# EAGLE schematic schematic-breadboard (EAGLE 7.4.0)
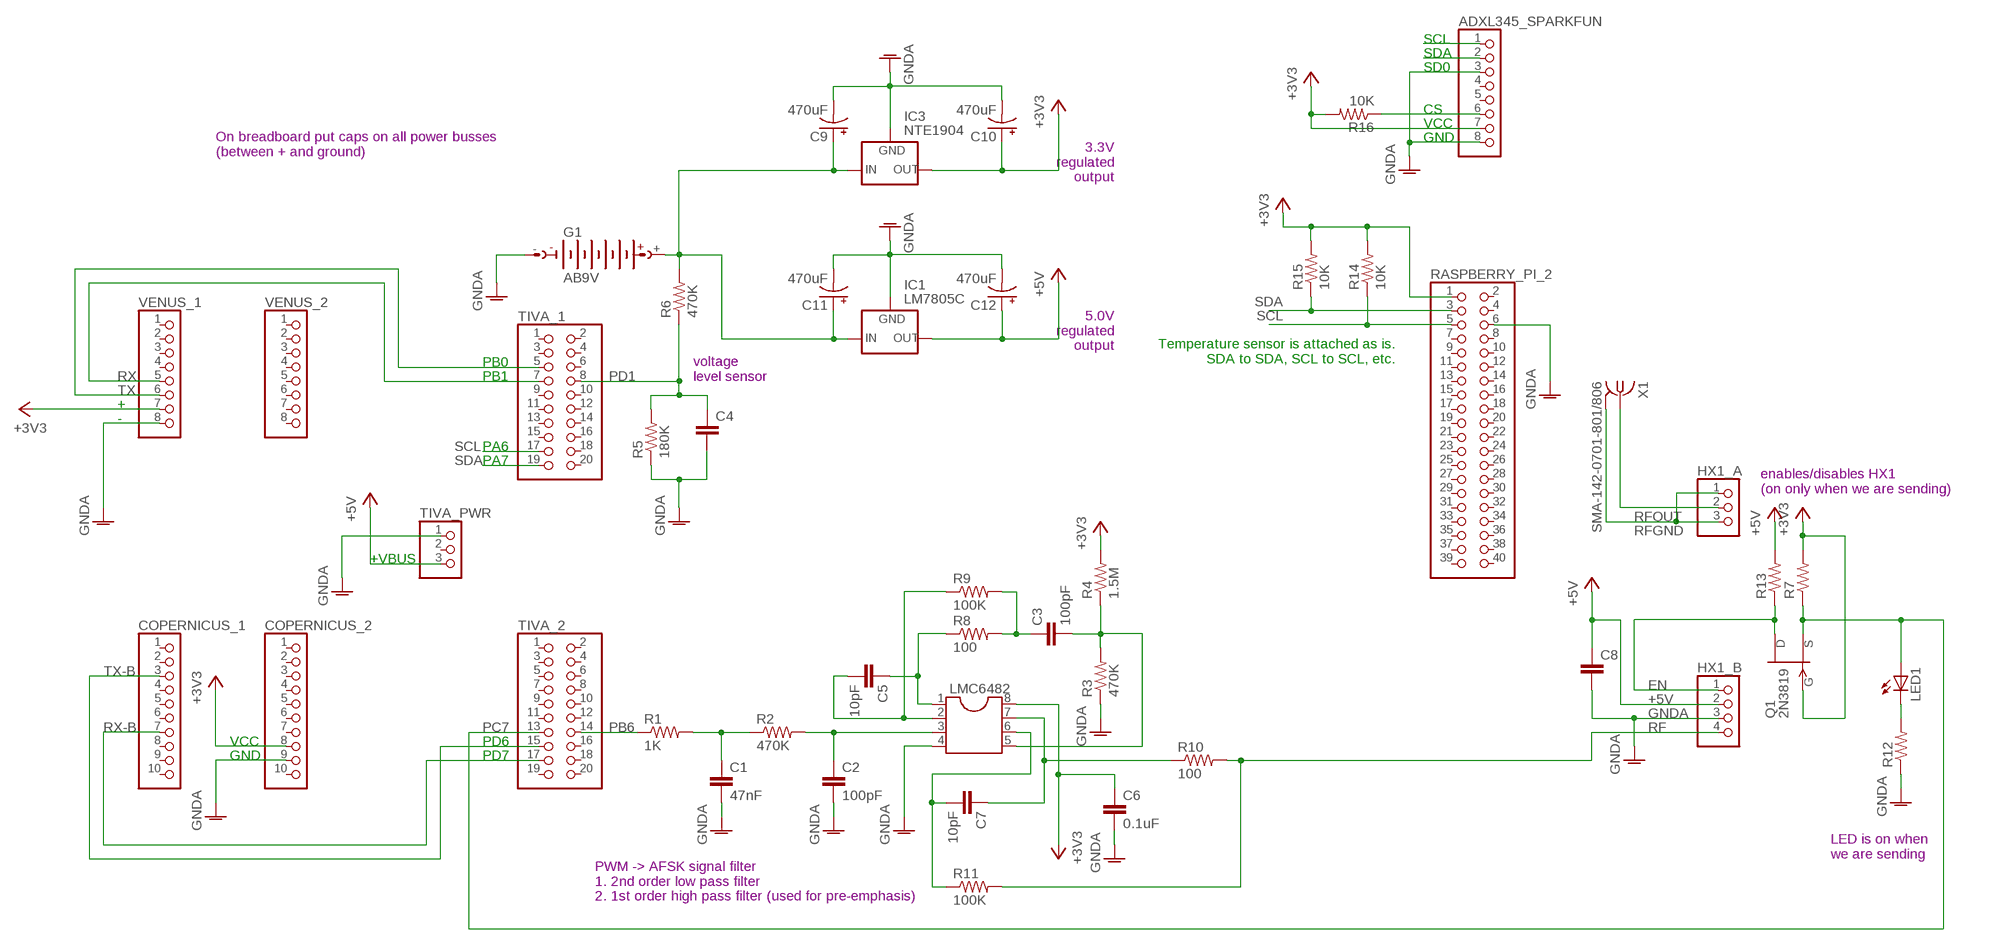
[diagram p0: schematic, sheet 1]

## Parts
ADXL345_SPARKFUN  PINHD-1X8  [1X08]
C1  47nF  C2.5/2  [C2.5-2]
C2  100pF  C2.5/2  [C2.5-2]
C3  100pF  C2.5/2  [C2.5-2]
C4  C2.5/2  [C2.5-2]
C5  10pF  C2.5/2  [C2.5-2]
C6  0.1uF  C2.5/2  [C2.5-2]
C7  10pF  C2.5/2  [C2.5-2]
C8  C2.5/2  [C2.5-2]
C9  470uF  CPOL-USE2,5-6E  [E2,5-6E]
C10  470uF  CPOL-USE2,5-6E  [E2,5-6E]
C11  470uF  CPOL-USE2,5-6E  [E2,5-6E]
C12  470uF  CPOL-USE2,5-6E  [E2,5-6E]
COPERNICUS_1  PINHD-1X10  [1X10]
COPERNICUS_2  PINHD-1X10  [1X10]
G1  AB9V  [AB9V]
HX1_A  PINHD-1X3  [1X03]
HX1_B  PINHD-1X4  [1X04]
IC1  LM7805C  79XXL  [79XXL]
IC3  NTE1904  79XXL  [79XXL]
LED1  LED3MM  [LED3MM]
LMC6482  DIL8  [DIL08]
Q1  2N3819  [TO92]
R1  1K  R-US_0204/2V  [0204V]
R2  470K  R-US_0204/2V  [0204V]
R3  470K  R-US_0204/2V  [0204V]
R4  1.5M  R-US_0204/2V  [0204V]
R5  180K  R-US_0204/2V  [0204V]
R6  470K  R-US_0204/2V  [0204V]
R7  R-US_0204/2V  [0204V]
R8  100  R-US_0204/2V  [0204V]
R9  100K  R-US_0204/2V  [0204V]
R10  100  R-US_0204/2V  [0204V]
R11  100K  R-US_0204/2V  [0204V]
R12  R-US_0204/2V  [0204V]
R13  R-US_0204/2V  [0204V]
R14  10K  R-US_0204/2V  [0204V]
R15  10K  R-US_0204/2V  [0204V]
R16  10K  R-US_0204/2V  [0204V]
RASPBERRY_PI_2  PINHD-2X20  [2X20]
TIVA_1  PINHD-2X10  [2X10]
TIVA_2  PINHD-2X10  [2X10]
TIVA_PWR  PINHD-1X3  [1X03]
VENUS_1  PINHD-1X8  [1X08]
VENUS_2  PINHD-1X8  [1X08]
X1  SMA-142-0701-801/806  [J502-ND-142-0701-801/806]

## Nets
+3V3: ADXL345_SPARKFUN.7 C6.1 C10.+ COPERNICUS_2.8 IC3.OUT LMC6482.8 Q1.2(G) R4.2 R7.2 R14.2 R15.2 R16.2 RASPBERRY_PI_2.1 VENUS_1.7
+5V: C8.1 C12.+ HX1_B.2 IC1.OUT R13.2 TIVA_PWR.3
+9V: C9.+ C11.+ G1.+ IC1.IN IC3.IN R6.2
EN: HX1_B.1 Q1.1(D) R13.1
GNDA: ADXL345_SPARKFUN.3 ADXL345_SPARKFUN.8 C1.2 C2.2 C4.2 C6.2 C8.2 C9.- C10.- C11.- C12.- COPERNICUS_2.9 G1.- HX1_B.3 IC1.GND IC3.GND LMC6482.4 R3.1 R5.1 R12.1 RASPBERRY_PI_2.6 TIVA_PWR.1 VENUS_1.8
N$2: C1.1 R1.2 R2.1
N$3: C2.1 LMC6482.3 R2.2
N$4: C7.2 LMC6482.6 R11.1
N$6: C3.2 LMC6482.5 R3.2 R4.1
N$8: C3.1 R8.2 R9.2
N$9: ADXL345_SPARKFUN.6 R16.1
N$12: C7.1 LMC6482.7 R10.1
N$13: C5.1 LMC6482.1 R8.1
N$15: C5.2 LMC6482.2 R9.1
N$17: LED1.K(C) R12.2
PB6: R1.1 TIVA_2.14
PC7: LED1.A Q1.3(S) R7.1 TIVA_2.13
PD1: C4.1 R5.2 R6.1 TIVA_1.8
RF: HX1_B.4 R10.2 R11.2
RFGND: HX1_A.1 HX1_A.3 X1.G@1 X1.G@2 X1.G@3 X1.G@4
RFOUT: HX1_A.2 X1.1
RX: TIVA_1.7 VENUS_1.5
RX-B: COPERNICUS_1.7 TIVA_2.17
SCL: R14.1 RASPBERRY_PI_2.5 TIVA_1.17
SDA: ADXL345_SPARKFUN.2 R15.1 RASPBERRY_PI_2.3 TIVA_1.19
SDL: ADXL345_SPARKFUN.1
TX: TIVA_1.5 VENUS_1.6
TX-B: COPERNICUS_1.3 TIVA_2.15
Unconnected: ADXL345_SPARKFUN.4 ADXL345_SPARKFUN.5 COPERNICUS_1.1 COPERNICUS_1.2 COPERNICUS_1.4 COPERNICUS_1.5 COPERNICUS_1.6 COPERNICUS_1.8 COPERNICUS_1.9 COPERNICUS_1.10 COPERNICUS_2.1 COPERNICUS_2.2 COPERNICUS_2.3 COPERNICUS_2.4 COPERNICUS_2.5 COPERNICUS_2.6 COPERNICUS_2.7 COPERNICUS_2.10 RASPBERRY_PI_2.2 RASPBERRY_PI_2.4 RASPBERRY_PI_2.7 RASPBERRY_PI_2.8 RASPBERRY_PI_2.9 RASPBERRY_PI_2.10 RASPBERRY_PI_2.11 RASPBERRY_PI_2.12 RASPBERRY_PI_2.13 RASPBERRY_PI_2.14 RASPBERRY_PI_2.15 RASPBERRY_PI_2.16 RASPBERRY_PI_2.17 RASPBERRY_PI_2.18 RASPBERRY_PI_2.19 RASPBERRY_PI_2.20 RASPBERRY_PI_2.21 RASPBERRY_PI_2.22 RASPBERRY_PI_2.23 RASPBERRY_PI_2.24 RASPBERRY_PI_2.25 RASPBERRY_PI_2.26 RASPBERRY_PI_2.27 RASPBERRY_PI_2.28 RASPBERRY_PI_2.29 RASPBERRY_PI_2.30 RASPBERRY_PI_2.31 RASPBERRY_PI_2.32 RASPBERRY_PI_2.33 RASPBERRY_PI_2.34 RASPBERRY_PI_2.35 RASPBERRY_PI_2.36 RASPBERRY_PI_2.37 RASPBERRY_PI_2.38 RASPBERRY_PI_2.39 RASPBERRY_PI_2.40 TIVA_1.1 TIVA_1.2 TIVA_1.3 TIVA_1.4 TIVA_1.6 TIVA_1.9 TIVA_1.10 TIVA_1.11 TIVA_1.12 TIVA_1.13 TIVA_1.14 TIVA_1.15 TIVA_1.16 TIVA_1.18 TIVA_1.20 TIVA_2.1 TIVA_2.2 TIVA_2.3 TIVA_2.4 TIVA_2.5 TIVA_2.6 TIVA_2.7 TIVA_2.8 TIVA_2.9 TIVA_2.10 TIVA_2.11 TIVA_2.12 TIVA_2.16 TIVA_2.18 TIVA_2.19 TIVA_2.20 TIVA_PWR.2 VENUS_1.1 VENUS_1.2 VENUS_1.3 VENUS_1.4 VENUS_2.1 VENUS_2.2 VENUS_2.3 VENUS_2.4 VENUS_2.5 VENUS_2.6 VENUS_2.7 VENUS_2.8

## Notes on the sheet
- SCL
- SDA
- SD0
- CS
- VCC
- 3.3V
  regulated
  output
- GND
- On breadboard put caps on all power busses
  (between + and ground)
- 5.0V
  regulated
  output
- Temperature sensor is attached as is.
  SDA to SDA, SCL to SCL, etc.
- PB0
- PB1
- voltage
  level sensor
- +
- -
- PA6
- PA7
- enables/disables HX1
  (on only when we are sending)
- +VBUS
- VCC | PD6
- GND | PD7
- LED is on when
  we are sending
- PWM -> AFSK signal filter
  1. 2nd order low pass filter
  2. 1st order high pass filter (used for pre-emphasis)

## Library data of the parts
ADXL345_SPARKFUN VENUS_1 VENUS_2 = pinhead:PINHD-1X8: PIN HEADER
C1-C8 = capacitor-wima:C: CAPACITOR naming: grid - package width
C9-C12 = rcl:CPOL-US: POLARIZED CAPACITOR, American symbol
COPERNICUS_1 COPERNICUS_2 = pinhead:PINHD-1X10: PIN HEADER
G1 = battery:AB9V: 9-V BATTERY CLIP
HX1_A TIVA_PWR = pinhead:PINHD-1X3: PIN HEADER
HX1_B = pinhead:PINHD-1X4: PIN HEADER
IC1 IC3 = v-reg:79XXL: VOLTAGE REGULATOR
LED1 = led:LED: LED OSRAM: - CHIPLED LG R971, LG N971, LY N971, LG Q971, LY Q971, LO R971, LY R971 LH N974, LH R974 LS Q976, LO Q976, LY Q976 LO Q996 - Hyper CHIPLED LW Q18S LB Q993, LB Q99A, LB R99A - SideLED LS A670, LO A670, LY A670, LG A670, LP A670 LB A673, LV A673, LT A673, LW A673 LH A674 LY A675 LS A676, LA A676, LO A676, LY A676, LW A676 LS A679, LY A679, LG A679 - Hyper Micro SIDELED® LS Y876, LA Y876, LO Y876, LY Y876 LT Y87S - SmartLED LW L88C, LW L88S LB L89C, LB L89S, LG L890 LS L89K, LO L89K, LY L89K LS L896, LA L896, LO L896, LY L896 - TOPLED LS T670, LO T670, LY T670, LG T670, LP T670 LSG T670, LSP T670, LSY T670, LOP T670, LYG T670 LG T671, LOG T671, LSG T671 LB T673, LV T673, LT T673, LW T673 LH T674 LS T676, LA T676, LO T676, LY T676, LB T676, LH T676, LSB T676, LW T676 LB T67C, LV T67C, LT T67C, LS T67K, LO T67K, LY T67K, LW E67C LS E67B, LA E67B, LO E67B, LY E67B, LB E67C, LV E67C, LT E67C LW T67C LS T679, LY T679, LG T679 LS T770, LO T770, LY T770, LG T770, LP T770 LB T773, LV T773, LT T773, LW T773 LH T774 LS E675, LA E675, LY E675, LS T675 LS T776, LA T776, LO T776, LY T776, LB T776 LHGB T686 LT T68C, LB T68C - Hyper Mini TOPLED® LB M676 - Mini TOPLED Santana® LG M470 LS M47K, LO M47K, LY M47K Source: http://www.osram.convergy.de LUXEON: - LUMILED® LXK2-PW12-R00, LXK2-PW12-S00, LXK2-PW14-U00, LXK2-PW14-V00 LXK2-PM12-R00, LXK2-PM12-S00, LXK2-PM14-U00 LXK2-PE12-Q00, LXK2-PE12-R00, LXK2-PE12-S00, LXK2-PE14-T00, LXK2-PE14-U00 LXK2-PB12-K00, LXK2-PB12-L00, LXK2-PB12-M00, LXK2-PB14-N00, LXK2-PB14-P00, LXK2-PB14-Q00 LXK2-PR12-L00, LXK2-PR12-M00, LXK2-PR14-Q00, LXK2-PR14-R00 LXK2-PD12-Q00, LXK2-PD12-R00, LXK2-PD12-S00 LXK2-PH12-R00, LXK2-PH12-S00 LXK2-PL12-P00, LXK2-PL12-Q00, LXK2-PL12-R00 Source: www.luxeon.com KINGBRIGHT: KA-3528ASYC Source: www.kingbright.com
LMC6482 = ic-package:DIL8: Dual In Line / Socket
Q1 = transistor-fet:2N3819: N-Channel Junction FET
R1-R16 = resistor:R-US_: RESISTOR, American symbol
RASPBERRY_PI_2 = pinhead:PINHD-2X20: PIN HEADER
TIVA_1 TIVA_2 = pinhead:PINHD-2X10: PIN HEADER
X1 = con-coax:SMA-: SMA 50 Ohm End Launch Jack Receptacle - Round Contact Johnson Components Source: www.johnsoncomponents.com .. J502-ND.pdf; MF: JOHNSON COMPONENTS; MPN: 142-0701-801; OC_FARNELL: 1608592; OC_NEWARK: 90F2624